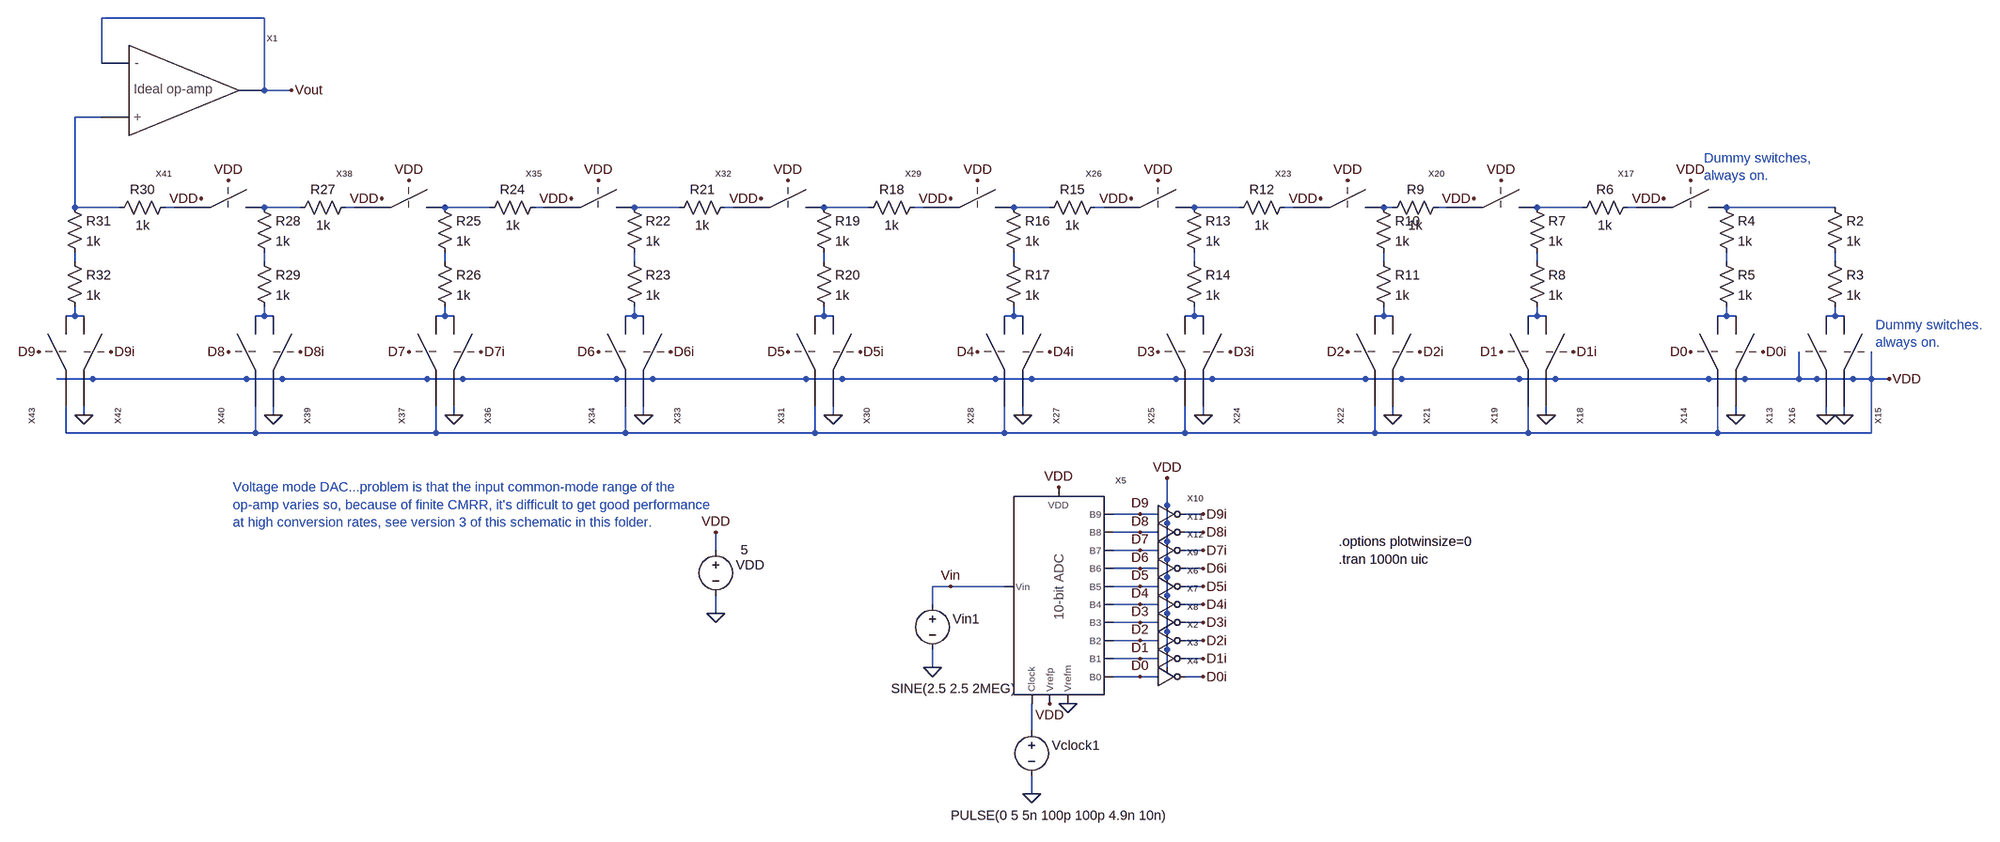
[diagram p0: schematic Fig29_5_v2.asc]
Fig29_5_v2.asc, the LTspice schematic file:
Version 4
SHEET 1 2492 2056
WIRE -992 624 -1280 624
WIRE -1280 704 -1280 624
WIRE -992 752 -992 624
WIRE -944 752 -992 752
WIRE -1280 800 -1328 800
WIRE -1328 960 -1328 800
WIRE -1248 960 -1328 960
WIRE -1152 960 -1168 960
WIRE -928 960 -992 960
WIRE -832 960 -848 960
WIRE -592 960 -672 960
WIRE -496 960 -512 960
WIRE -256 960 -336 960
WIRE -160 960 -176 960
WIRE 80 960 0 960
WIRE 176 960 160 960
WIRE 336 960 320 960
WIRE 400 960 336 960
WIRE 496 960 480 960
WIRE 736 960 656 960
WIRE 832 960 816 960
WIRE 1008 960 992 960
WIRE 1104 960 1088 960
WIRE 1344 960 1264 960
WIRE 1440 960 1424 960
WIRE 1792 960 1600 960
WIRE -1328 1056 -1328 1040
WIRE -992 1056 -992 1040
WIRE -672 1056 -672 1040
WIRE -336 1056 -336 1040
WIRE 0 1056 0 1040
WIRE 336 1056 336 1040
WIRE 656 1056 656 1040
WIRE 992 1056 992 1040
WIRE 1264 1056 1264 1040
WIRE 1600 1056 1600 1040
WIRE 1792 1056 1792 1040
WIRE -1328 1152 -1328 1136
WIRE -1328 1152 -1344 1152
WIRE -1312 1152 -1328 1152
WIRE -992 1152 -992 1136
WIRE -992 1152 -1008 1152
WIRE -976 1152 -992 1152
WIRE -672 1152 -672 1136
WIRE -672 1152 -688 1152
WIRE -656 1152 -672 1152
WIRE -336 1152 -336 1136
WIRE -336 1152 -352 1152
WIRE -320 1152 -336 1152
WIRE 0 1152 0 1136
WIRE 0 1152 -16 1152
WIRE 16 1152 0 1152
WIRE 336 1152 336 1136
WIRE 336 1152 320 1152
WIRE 352 1152 336 1152
WIRE 656 1152 656 1136
WIRE 656 1152 640 1152
WIRE 672 1152 656 1152
WIRE 992 1152 992 1136
WIRE 992 1152 976 1152
WIRE 1008 1152 992 1152
WIRE 1264 1152 1264 1136
WIRE 1264 1152 1248 1152
WIRE 1280 1152 1264 1152
WIRE 1600 1152 1600 1136
WIRE 1600 1152 1584 1152
WIRE 1616 1152 1600 1152
WIRE 1792 1152 1792 1136
WIRE 1792 1152 1776 1152
WIRE 1808 1152 1792 1152
WIRE -1296 1264 -1360 1264
WIRE -1024 1264 -1296 1264
WIRE -960 1264 -1024 1264
WIRE -704 1264 -960 1264
WIRE -640 1264 -704 1264
WIRE -368 1264 -640 1264
WIRE -304 1264 -368 1264
WIRE -32 1264 -304 1264
WIRE 32 1264 -32 1264
WIRE 304 1264 32 1264
WIRE 368 1264 304 1264
WIRE 624 1264 368 1264
WIRE 688 1264 624 1264
WIRE 960 1264 688 1264
WIRE 1024 1264 960 1264
WIRE 1232 1264 1024 1264
WIRE 1296 1264 1232 1264
WIRE 1568 1264 1296 1264
WIRE 1632 1264 1568 1264
WIRE 1728 1264 1728 1216
WIRE 1728 1264 1632 1264
WIRE 1760 1264 1728 1264
WIRE 1824 1264 1760 1264
WIRE 1856 1264 1856 1216
WIRE 1856 1264 1824 1264
WIRE 1888 1264 1856 1264
WIRE -1312 1328 -1312 1312
WIRE -976 1328 -976 1312
WIRE -656 1328 -656 1312
WIRE -320 1328 -320 1312
WIRE 16 1328 16 1312
WIRE 352 1328 352 1312
WIRE 672 1328 672 1312
WIRE 1008 1328 1008 1312
WIRE 1280 1328 1280 1312
WIRE 1616 1328 1616 1312
WIRE 1776 1328 1776 1312
WIRE 1808 1328 1808 1312
WIRE -1344 1360 -1344 1312
WIRE -1008 1360 -1008 1312
WIRE -1008 1360 -1344 1360
WIRE -688 1360 -688 1312
WIRE -688 1360 -1008 1360
WIRE -352 1360 -352 1312
WIRE -352 1360 -688 1360
WIRE -16 1360 -16 1312
WIRE -16 1360 -352 1360
WIRE 320 1360 320 1312
WIRE 320 1360 -16 1360
WIRE 640 1360 640 1312
WIRE 640 1360 320 1360
WIRE 976 1360 976 1312
WIRE 976 1360 640 1360
WIRE 1248 1360 1248 1312
WIRE 1248 1360 976 1360
WIRE 1584 1360 1584 1312
WIRE 1584 1360 1248 1360
WIRE 1856 1360 1856 1264
WIRE 1856 1360 1584 1360
WIRE 608 1488 608 1440
WIRE 560 1504 512 1504
WIRE 592 1504 560 1504
WIRE 672 1504 640 1504
WIRE 608 1520 608 1488
WIRE 560 1536 512 1536
WIRE 592 1536 560 1536
WIRE 672 1536 640 1536
WIRE 608 1552 608 1520
WIRE -192 1568 -192 1536
WIRE 560 1568 512 1568
WIRE 592 1568 560 1568
WIRE 672 1568 640 1568
WIRE 608 1584 608 1552
WIRE 560 1600 512 1600
WIRE 592 1600 560 1600
WIRE 672 1600 640 1600
WIRE 608 1616 608 1584
WIRE 224 1632 192 1632
WIRE 320 1632 224 1632
WIRE 560 1632 512 1632
WIRE 592 1632 560 1632
WIRE 672 1632 640 1632
WIRE 608 1648 608 1616
WIRE 192 1664 192 1632
WIRE 560 1664 512 1664
WIRE 592 1664 560 1664
WIRE 672 1664 640 1664
WIRE -192 1680 -192 1648
WIRE 608 1680 608 1648
WIRE 560 1696 512 1696
WIRE 592 1696 560 1696
WIRE 672 1696 640 1696
WIRE 608 1712 608 1680
WIRE 560 1728 512 1728
WIRE 592 1728 560 1728
WIRE 672 1728 640 1728
WIRE 608 1744 608 1712
WIRE 560 1760 512 1760
WIRE 592 1760 560 1760
WIRE 672 1760 640 1760
WIRE 192 1776 192 1744
WIRE 608 1776 608 1744
WIRE 560 1792 512 1792
WIRE 592 1792 560 1792
WIRE 672 1792 640 1792
WIRE 368 1888 368 1840
WIRE 368 2000 368 1968
FLAG -192 1680 0
FLAG -192 1536 VDD
FLAG 560 1792 D0
FLAG 560 1760 D1
FLAG 560 1728 D2
FLAG 672 1728 D2i
FLAG 672 1760 D1i
FLAG 672 1792 D0i
FLAG 416 1456 VDD
FLAG 368 2000 0
FLAG 432 1840 0
FLAG 400 1840 VDD
FLAG 192 1776 0
FLAG 224 1632 Vin
FLAG -944 752 Vout
FLAG 560 1696 D3
FLAG 560 1664 D4
FLAG 560 1632 D5
FLAG 672 1632 D5i
FLAG 672 1664 D4i
FLAG 672 1696 D3i
FLAG 560 1600 D6
FLAG 672 1600 D6i
FLAG 560 1568 D7
FLAG 560 1536 D8
FLAG 560 1504 D9
FLAG 608 1440 VDD
FLAG 672 1504 D9i
FLAG 672 1536 D8i
FLAG 672 1568 D7i
FLAG 1536 1216 D0
FLAG 1664 1216 D0i
FLAG 1808 1328 0
FLAG 1776 1328 0
FLAG 1616 1328 0
FLAG 1488 944 VDD
FLAG 1536 912 VDD
FLAG 1200 1216 D1
FLAG 1328 1216 D1i
FLAG 1280 1328 0
FLAG 1152 944 VDD
FLAG 1200 912 VDD
FLAG 928 1216 D2
FLAG 1056 1216 D2i
FLAG 1008 1328 0
FLAG 880 944 VDD
FLAG 928 912 VDD
FLAG 592 1216 D3
FLAG 720 1216 D3i
FLAG 672 1328 0
FLAG 544 944 VDD
FLAG 592 912 VDD
FLAG 272 1216 D4
FLAG 400 1216 D4i
FLAG 352 1328 0
FLAG 224 944 VDD
FLAG 272 912 VDD
FLAG -64 1216 D5
FLAG 64 1216 D5i
FLAG 16 1328 0
FLAG -112 944 VDD
FLAG -64 912 VDD
FLAG -400 1216 D6
FLAG -272 1216 D6i
FLAG -320 1328 0
FLAG -448 944 VDD
FLAG -400 912 VDD
FLAG -736 1216 D7
FLAG -608 1216 D7i
FLAG -656 1328 0
FLAG -784 944 VDD
FLAG -736 912 VDD
FLAG -1056 1216 D8
FLAG -928 1216 D8i
FLAG -976 1328 0
FLAG -1104 944 VDD
FLAG -1056 912 VDD
FLAG -1392 1216 D9
FLAG -1264 1216 D9i
FLAG -1312 1328 0
FLAG 1888 1264 VDD
SYMBOL voltage -192 1552 R0
WINDOW 0 36 42 Left 0
WINDOW 3 44 15 Left 0
WINDOW 123 0 0 Left 0
WINDOW 39 0 0 Left 0
SYMATTR InstName VDD
SYMATTR Value 5
SYMBOL inverter 592 1728 R0
SYMATTR InstName X2
SYMBOL inverter 592 1760 R0
SYMATTR InstName X3
SYMBOL inverter 592 1792 R0
SYMATTR InstName X4
SYMBOL voltage 368 1872 R0
WINDOW 0 36 42 Left 0
WINDOW 3 -143 166 Left 0
WINDOW 123 0 0 Left 0
WINDOW 39 0 0 Left 0
SYMATTR InstName Vclock1
SYMATTR Value PULSE(0 5 5n 100p 100p 4.9n 10n)
SYMBOL voltage 192 1648 R0
WINDOW 0 36 42 Left 0
WINDOW 3 -73 165 Left 0
WINDOW 123 0 0 Left 0
WINDOW 39 0 0 Left 0
SYMATTR InstName Vin1
SYMATTR Value SINE(2.5 2.5 2MEG)
SYMBOL Ideal_op_amp -1232 752 R0
SYMATTR InstName X1
SYMBOL Ideal_10_bit_ADC 336 1824 R0
SYMATTR InstName X5
SYMBOL inverter 592 1632 R0
SYMATTR InstName X6
SYMBOL inverter 592 1664 R0
SYMATTR InstName X7
SYMBOL inverter 592 1696 R0
SYMATTR InstName X8
SYMBOL inverter 592 1600 R0
SYMATTR InstName X9
SYMBOL inverter 592 1504 R0
SYMATTR InstName X10
SYMBOL inverter 592 1536 R0
SYMATTR InstName X11
SYMBOL inverter 592 1568 R0
SYMATTR InstName X12
SYMBOL res 1776 944 R0
SYMATTR InstName R2
SYMATTR Value 1k
SYMBOL res 1776 1040 R0
SYMATTR InstName R3
SYMATTR Value 1k
SYMBOL res 1584 944 R0
SYMATTR InstName R4
SYMATTR Value 1k
SYMBOL res 1584 1040 R0
SYMATTR InstName R5
SYMATTR Value 1k
SYMBOL switch_1 1600 1152 R90
SYMATTR InstName X13
SYMBOL switch_1 1600 1152 M90
SYMATTR InstName X14
SYMBOL switch_1 1792 1152 R90
SYMATTR InstName X15
SYMBOL switch_1 1792 1152 M90
SYMATTR InstName X16
SYMBOL res 1328 976 R270
WINDOW 0 32 56 VTop 0
WINDOW 3 0 56 VBottom 0
SYMATTR InstName R6
SYMATTR Value 1k
SYMBOL switch_1 1600 976 M0
SYMATTR InstName X17
SYMBOL res 1248 944 R0
SYMATTR InstName R7
SYMATTR Value 1k
SYMBOL res 1248 1040 R0
SYMATTR InstName R8
SYMATTR Value 1k
SYMBOL switch_1 1264 1152 R90
SYMATTR InstName X18
SYMBOL switch_1 1264 1152 M90
SYMATTR InstName X19
SYMBOL res 992 976 R270
WINDOW 0 32 56 VTop 0
WINDOW 3 0 56 VBottom 0
SYMATTR InstName R9
SYMATTR Value 1k
SYMBOL switch_1 1264 976 M0
SYMATTR InstName X20
SYMBOL res 976 944 R0
SYMATTR InstName R10
SYMATTR Value 1k
SYMBOL res 976 1040 R0
SYMATTR InstName R11
SYMATTR Value 1k
SYMBOL switch_1 992 1152 R90
SYMATTR InstName X21
SYMBOL switch_1 992 1152 M90
SYMATTR InstName X22
SYMBOL res 720 976 R270
WINDOW 0 32 56 VTop 0
WINDOW 3 0 56 VBottom 0
SYMATTR InstName R12
SYMATTR Value 1k
SYMBOL switch_1 992 976 M0
SYMATTR InstName X23
SYMBOL res 640 944 R0
SYMATTR InstName R13
SYMATTR Value 1k
SYMBOL res 640 1040 R0
SYMATTR InstName R14
SYMATTR Value 1k
SYMBOL switch_1 656 1152 R90
SYMATTR InstName X24
SYMBOL switch_1 656 1152 M90
SYMATTR InstName X25
SYMBOL res 384 976 R270
WINDOW 0 32 56 VTop 0
WINDOW 3 0 56 VBottom 0
SYMATTR InstName R15
SYMATTR Value 1k
SYMBOL switch_1 656 976 M0
SYMATTR InstName X26
SYMBOL res 320 944 R0
SYMATTR InstName R16
SYMATTR Value 1k
SYMBOL res 320 1040 R0
SYMATTR InstName R17
SYMATTR Value 1k
SYMBOL switch_1 336 1152 R90
SYMATTR InstName X27
SYMBOL switch_1 336 1152 M90
SYMATTR InstName X28
SYMBOL res 64 976 R270
WINDOW 0 32 56 VTop 0
WINDOW 3 0 56 VBottom 0
SYMATTR InstName R18
SYMATTR Value 1k
SYMBOL switch_1 336 976 M0
SYMATTR InstName X29
SYMBOL res -16 944 R0
SYMATTR InstName R19
SYMATTR Value 1k
SYMBOL res -16 1040 R0
SYMATTR InstName R20
SYMATTR Value 1k
SYMBOL switch_1 0 1152 R90
SYMATTR InstName X30
SYMBOL switch_1 0 1152 M90
SYMATTR InstName X31
SYMBOL res -272 976 R270
WINDOW 0 32 56 VTop 0
WINDOW 3 0 56 VBottom 0
SYMATTR InstName R21
SYMATTR Value 1k
SYMBOL switch_1 0 976 M0
SYMATTR InstName X32
SYMBOL res -352 944 R0
SYMATTR InstName R22
SYMATTR Value 1k
SYMBOL res -352 1040 R0
SYMATTR InstName R23
SYMATTR Value 1k
SYMBOL switch_1 -336 1152 R90
SYMATTR InstName X33
SYMBOL switch_1 -336 1152 M90
SYMATTR InstName X34
SYMBOL res -608 976 R270
WINDOW 0 32 56 VTop 0
WINDOW 3 0 56 VBottom 0
SYMATTR InstName R24
SYMATTR Value 1k
SYMBOL switch_1 -336 976 M0
SYMATTR InstName X35
SYMBOL res -688 944 R0
SYMATTR InstName R25
SYMATTR Value 1k
SYMBOL res -688 1040 R0
SYMATTR InstName R26
SYMATTR Value 1k
SYMBOL switch_1 -672 1152 R90
SYMATTR InstName X36
SYMBOL switch_1 -672 1152 M90
SYMATTR InstName X37
SYMBOL res -944 976 R270
WINDOW 0 32 56 VTop 0
WINDOW 3 0 56 VBottom 0
SYMATTR InstName R27
SYMATTR Value 1k
SYMBOL switch_1 -672 976 M0
SYMATTR InstName X38
SYMBOL res -1008 944 R0
SYMATTR InstName R28
SYMATTR Value 1k
SYMBOL res -1008 1040 R0
SYMATTR InstName R29
SYMATTR Value 1k
SYMBOL switch_1 -992 1152 R90
SYMATTR InstName X39
SYMBOL switch_1 -992 1152 M90
SYMATTR InstName X40
SYMBOL res -1264 976 R270
WINDOW 0 32 56 VTop 0
WINDOW 3 0 56 VBottom 0
SYMATTR InstName R30
SYMATTR Value 1k
SYMBOL switch_1 -992 976 M0
SYMATTR InstName X41
SYMBOL res -1344 944 R0
SYMATTR InstName R31
SYMATTR Value 1k
SYMBOL res -1344 1040 R0
SYMATTR InstName R32
SYMATTR Value 1k
SYMBOL switch_1 -1328 1152 R90
SYMATTR InstName X42
SYMBOL switch_1 -1328 1152 M90
SYMATTR InstName X43
TEXT 912 1584 Left 0 !.tran 1000n uic
TEXT 912 1552 Left 0 !.options plotwinsize=0
TEXT 1560 872 Left 0 ;Dummy switches,\nalways on.
TEXT 1864 1168 Left 0 ;Dummy switches.\nalways on.
TEXT -1048 1456 Left 0 ;Voltage mode DAC...problem is that the input common-mode range of the \nop-amp varies so, because of finite CMRR, it's difficult to get good performance\nat high conversion rates, see version 3 of this schematic in this folder.

The netlist it stands for:
* Fig29_5_v2.asc
VDD VDD 0 5
XX2 D2 D2i VDD inverter  ; pins In Out VDD
XX3 D1 D1i VDD inverter  ; pins In Out VDD
XX4 D0 D0i VDD inverter  ; pins In Out VDD
Vclock1 N042 0 PULSE(0 5 5n 100p 100p 4.9n 10n)
Vin1 Vin 0 SINE(2.5 2.5 2MEG)
XX1 Vout N001 Vout Ideal_op_amp  ; pins Vinm Vinp Out
XX5 D0 D1 D2 D3 D4 D5 D6 D7 D8 D9 Vin VDD 0 N042 VDD Ideal_10_bit_ADC  ; pins B0 B1 B2 B3 B4 B5 B6 B7 B8 B9 Vin Vrefp Vrefm Clock VDD
XX6 D5 D5i VDD inverter  ; pins In Out VDD
XX7 D4 D4i VDD inverter  ; pins In Out VDD
XX8 D3 D3i VDD inverter  ; pins In Out VDD
XX9 D6 D6i VDD inverter  ; pins In Out VDD
XX10 D9 D9i VDD inverter  ; pins In Out VDD
XX11 D8 D8i VDD inverter  ; pins In Out VDD
XX12 D7 D7i VDD inverter  ; pins In Out VDD
R2 N019 N030 1k
R3 N030 N041 1k
R4 N019 N029 1k
R5 N029 N040 1k
XX13 N040 0 D0i VDD switch_1  ; pins P1 P2 clk VDD
XX14 N040 VDD D0 VDD switch_1  ; pins P1 P2 clk VDD
XX15 N041 0 VDD VDD switch_1  ; pins P1 P2 clk VDD
XX16 N041 0 VDD VDD switch_1  ; pins P1 P2 clk VDD
R6 N017 N018 1k
XX17 N019 N018 VDD VDD switch_1  ; pins P1 P2 clk VDD
R7 N017 N028 1k
R8 N028 N039 1k
XX18 N039 0 D1i VDD switch_1  ; pins P1 P2 clk VDD
XX19 N039 VDD D1 VDD switch_1  ; pins P1 P2 clk VDD
R9 N015 N016 1k
XX20 N017 N016 VDD VDD switch_1  ; pins P1 P2 clk VDD
R10 N015 N027 1k
R11 N027 N038 1k
XX21 N038 0 D2i VDD switch_1  ; pins P1 P2 clk VDD
XX22 N038 VDD D2 VDD switch_1  ; pins P1 P2 clk VDD
R12 N013 N014 1k
XX23 N015 N014 VDD VDD switch_1  ; pins P1 P2 clk VDD
R13 N013 N026 1k
R14 N026 N037 1k
XX24 N037 0 D3i VDD switch_1  ; pins P1 P2 clk VDD
XX25 N037 VDD D3 VDD switch_1  ; pins P1 P2 clk VDD
R15 N011 N012 1k
XX26 N013 N012 VDD VDD switch_1  ; pins P1 P2 clk VDD
R16 N011 N025 1k
R17 N025 N036 1k
XX27 N036 0 D4i VDD switch_1  ; pins P1 P2 clk VDD
XX28 N036 VDD D4 VDD switch_1  ; pins P1 P2 clk VDD
R18 N009 N010 1k
XX29 N011 N010 VDD VDD switch_1  ; pins P1 P2 clk VDD
R19 N009 N024 1k
R20 N024 N035 1k
XX30 N035 0 D5i VDD switch_1  ; pins P1 P2 clk VDD
XX31 N035 VDD D5 VDD switch_1  ; pins P1 P2 clk VDD
R21 N007 N008 1k
XX32 N009 N008 VDD VDD switch_1  ; pins P1 P2 clk VDD
R22 N007 N023 1k
R23 N023 N034 1k
XX33 N034 0 D6i VDD switch_1  ; pins P1 P2 clk VDD
XX34 N034 VDD D6 VDD switch_1  ; pins P1 P2 clk VDD
R24 N005 N006 1k
XX35 N007 N006 VDD VDD switch_1  ; pins P1 P2 clk VDD
R25 N005 N022 1k
R26 N022 N033 1k
XX36 N033 0 D7i VDD switch_1  ; pins P1 P2 clk VDD
XX37 N033 VDD D7 VDD switch_1  ; pins P1 P2 clk VDD
R27 N003 N004 1k
XX38 N005 N004 VDD VDD switch_1  ; pins P1 P2 clk VDD
R28 N003 N021 1k
R29 N021 N032 1k
XX39 N032 0 D8i VDD switch_1  ; pins P1 P2 clk VDD
XX40 N032 VDD D8 VDD switch_1  ; pins P1 P2 clk VDD
R30 N001 N002 1k
XX41 N003 N002 VDD VDD switch_1  ; pins P1 P2 clk VDD
R31 N001 N020 1k
R32 N020 N031 1k
XX42 N031 0 D9i VDD switch_1  ; pins P1 P2 clk VDD
XX43 N031 VDD D9 VDD switch_1  ; pins P1 P2 clk VDD
.tran 1000n uic
.options plotwinsize=0
* Dummy switches,
* always on.
* Dummy switches.
* always on.
* Voltage mode DAC...problem is that the input common-mode range of the
* op-amp varies so, because of finite CMRR, it's difficult to get good performance
* at high conversion rates, see version 3 of this schematic in this folder.
.backanno
.end